# EAGLE design PCB-MIDI-OUT (EAGLE 7.5.0)

## Sheet 1 of 2
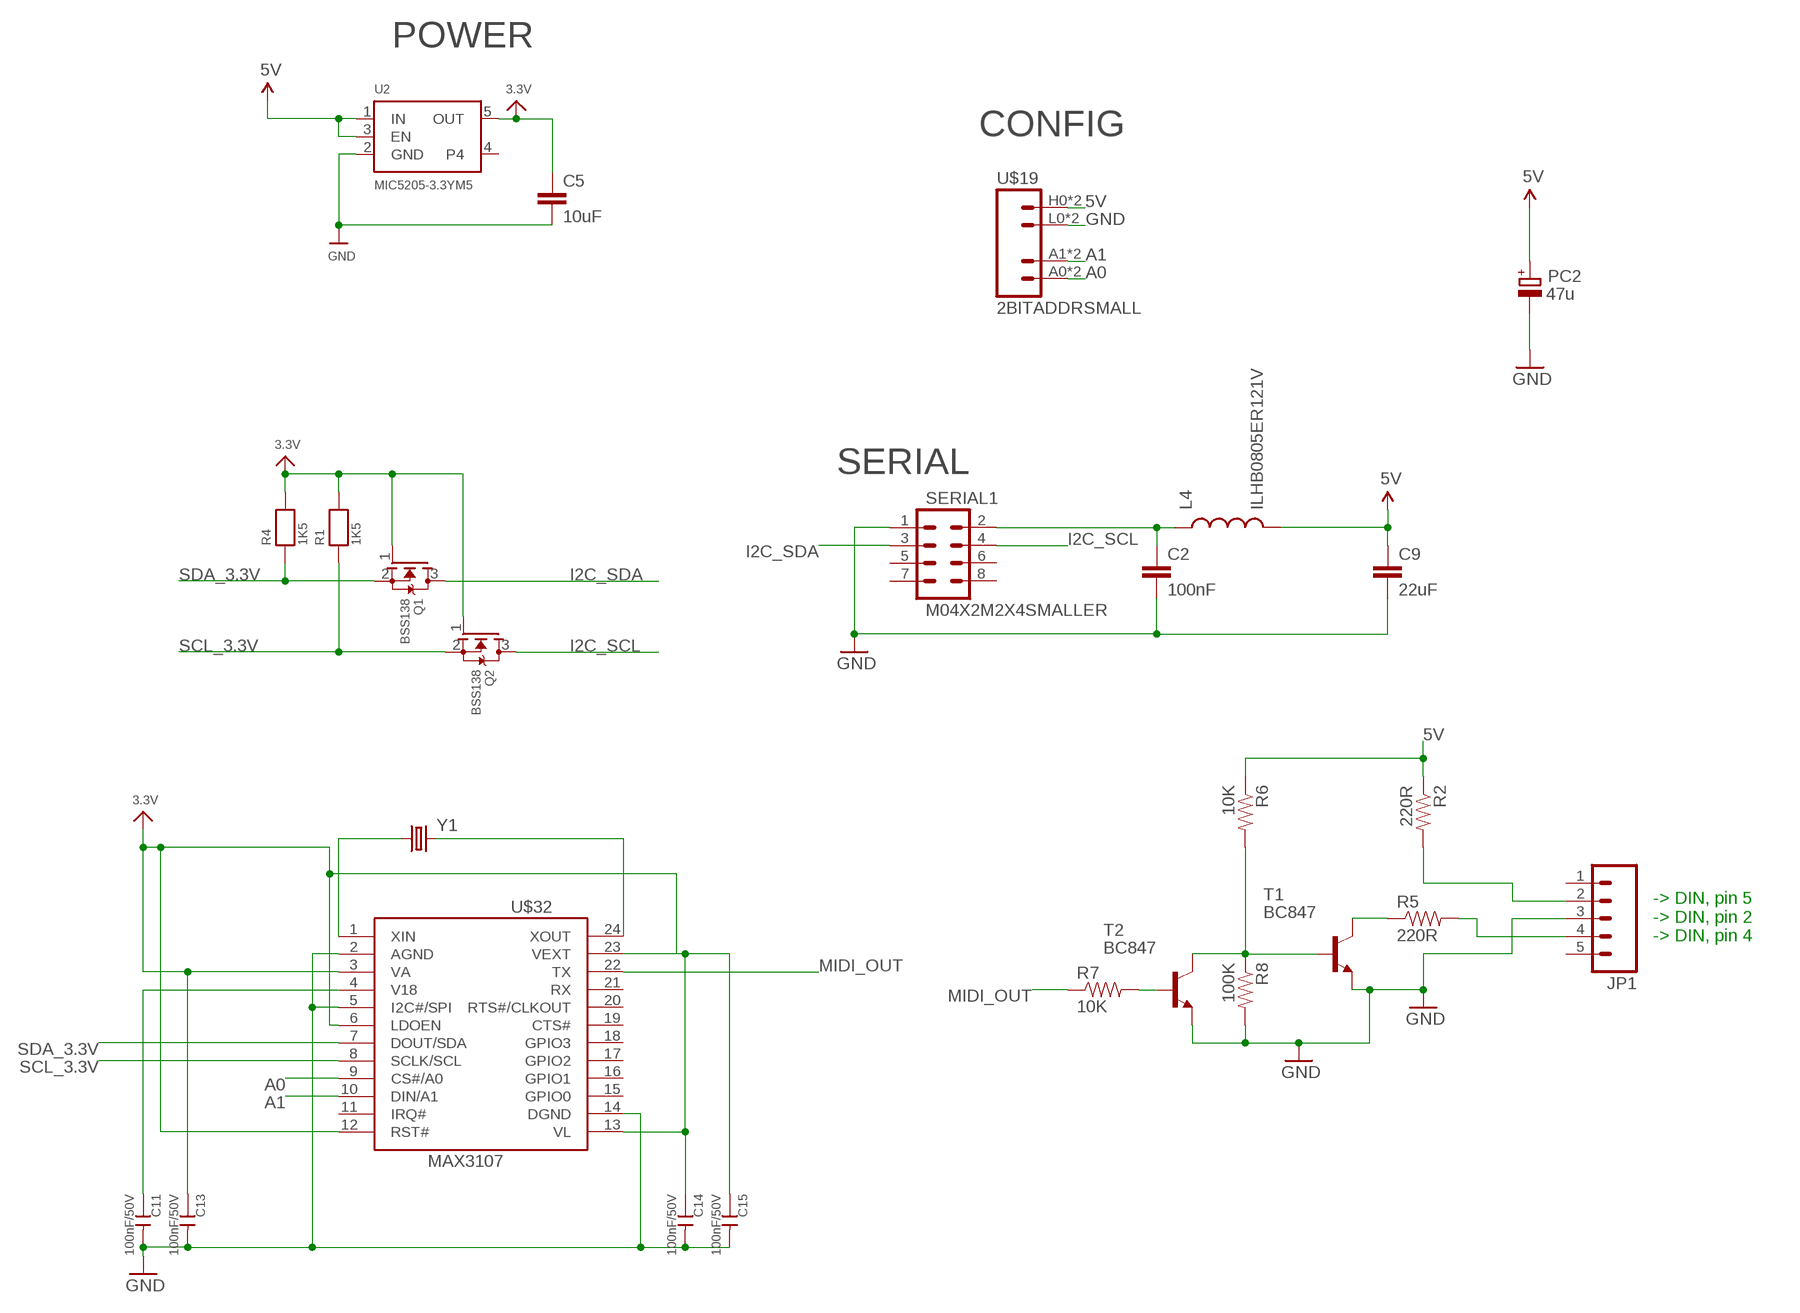
[diagram p0: schematic, sheet 1]

### Parts
C2  100nF  CAP0603-CAP  [0603-CAP]
C5  10uF  CAP0805  [0805]
C9  22uF  CAP0805  [0805]
C11  100nF/50V  CAP-0603  [C0603]
C13  100nF/50V  CAP-0603  [C0603]
C14  100nF/50V  CAP-0603  [C0603]
C15  100nF/50V  CAP-0603  [C0603]
JP1  M05LOCK  [1X05_LOCK]
L4  ILHB0805ER121V  INDUCTOR0805  [0805]
PC2  47u  CPOL-EUD  [PANASONIC_D]
Q1  BSS138  MOSFET-NREFLOW  [SOT23-R]
Q2  BSS138  MOSFET-NREFLOW  [SOT23-R]
R1  1K5  RESISTOR0603  [0603]
R2  220R  RESISTOR0603-RES  [0603-RES]
R4  1K5  RESISTOR0603  [0603]
R5  220R  RESISTOR0603-RES  [0603-RES]
R6  10K  RESISTOR0603-RES  [0603-RES]
R7  10K  RESISTOR0603-RES  [0603-RES]
R8  100K  RESISTOR0603-RES  [0603-RES]
SERIAL1  M04X2M2X4SMALLER  [M2X4SMALLER]
T1  BC847  [SOT23]
T2  BC847  [SOT23]
U2  MIC5205-3.3YM5  VREG_SOT23-5  [SOT23-5]
U$19  2BITADDRSMALL  [2BITADDR_SMALL]
U$32  MAX3107  [SSOP24]
Y1  CRYSTALHC49US  [HC49US]

### Nets
3.3V [Power]: C5.1 C13.1 C14.1 C15.1 Q1.1(G) Q2.1(G) R1.2 R4.2 U2.5(OUT) U$32.3(VA) U$32.6(LDOEN) U$32.12(RST#) U$32.13(VL) U$32.23(VEXT)
5V [Power]: C9.1 L4.2 PC2.+ R2.1 R6.1 U2.1(IN) U2.3(EN) U$19.H0(VCC) U$19.H1(VCC)
A0: U$19.A0(A1) U$19.AS0(A1) U$32.9(CS#/A0)
A1: U$19.A1(A2) U$19.AS1(A2) U$32.10(DIN/A1)
GND [Power]: C2.2 C5.2 C9.2 C11.2 C13.2 C14.2 C15.2 JP1.3 PC2.- R8.2 SERIAL1.1 T1.2(E) T2.2(E) U2.2(GND) U$19.L0(GND) U$19.L1(GND) U$32.2(AGND) U$32.5(I2C#/SPI) U$32.14(DGND)
I2C_SCL: Q2.3(D) SERIAL1.4
I2C_SDA: Q1.3(D) SERIAL1.3
MIDI_OUT: R7.1 U$32.22(TX)
N$3 [Power]: C2.1 L4.1 SERIAL1.2
N$4: R6.2 R8.1 T1.1(B) T2.3(C)
N$5: JP1.2 R2.2
N$6: C11.1 U$32.4(V18)
N$8: R5.1 T1.3(C)
N$9: JP1.4 R5.2
N$11: U$32.1(XIN) Y1.1
N$12: R7.2 T2.1(B)
N$27: U$32.24(XOUT) Y1.2
SCL_3.3V: Q2.2(S) R1.1 U$32.8(SCLK/SCL)
SDA_3.3V: Q1.2(S) R4.1 U$32.7(DOUT/SDA)
Unconnected: JP1.1 JP1.5 SERIAL1.5 SERIAL1.6 SERIAL1.7 SERIAL1.8 U2.4 U$32.11(IRQ#) U$32.15(GPIO0) U$32.16(GPIO1) U$32.17(GPIO2) U$32.18(GPIO3) U$32.19(CTS#) U$32.20(RTS#/CLKOUT) U$32.21(RX)

### Notes on the sheet
- POWER
- CONFIG
- SERIAL
- -> DIN, pin 5
  -> DIN, pin 2
  -> DIN, pin 4

## Sheet 2 of 2

## Library data of the parts
C2 C5 C9 = SparkFun:CAP: Capacitor Standard 0603 ceramic capacitor, and 0.1" leaded capacitor.
C11 C13-C15 = OPL:CAP: Ceramic Capacitors
JP1 = SparkFun:M05: Header 5 Standard 5-pin 0.1" header. Use with straight break away headers (SKU : PRT-00116), right angle break away headers (PRT-00553), swiss pins (PRT-00743), machine pins (PRT-00117), and female headers (PRT-00115). Molex polarized connector foot print use with SKU : PRT-08230 with associated crimp pins and housings.
L4 = SparkFun:INDUCTOR: Inductors Basic Inductor/Choke - 0603 and 1206. Footprints are not proven and vary greatly between part numbers.
PC2 = rcl:CPOL-EU: POLARIZED CAPACITOR, European symbol
Q1 Q2 = microbuilder:MOSFET-N: N-Channel Mosfet LEGEND VDS: Voltage Drain-Source ID: Drain Current RDS(ON): Drain-Source On-State Resistance VGS(TH): Gate-Source Threshold Voltage CISS: Drain-Source Input Capacitance SOT-23 Name VDS ID RDS(ON) VGS(TH) CISS Order Number 2N7002E 60V 260mA 2.5 Ohm 2.5V @ 250uA 26.7pF @ 25V 2N7002ET1GOSTR-ND BSH103 30V 850mA 400 mOhm 400mV @ 1mA 83pF @ 24V BSH103,235-ND BSS138 60V 320mA 1.6 Ohm 1.5V @ 250uA 50pF @ 10V Mouser: 771-BSS138PW115 DMN2075U-7 20V 4.2A 38 mOhm 1V @ 250 uA 594.3pF @ 10V DMN2075U-7DICT-ND * BSS138 good choice for I2C level-shifting
R1 R4 = microbuilder:RESISTOR: Resistors 0402 - 0402 Surface Mount Package 22 Ohm 1% 1/16W [Digikey: 311-22.0LRTR-ND] 33 Ohm 5% 1/16W 1.0K 5% 1/16W 1.5K 5% 1/16W 2.0K 1% 1/16W 10.0K 1% 1/16W [Digikey: 311-10.0KLRTR-ND] 10.0K 5% 1/16W [Digikey: RMCF0402JT10K0TR-ND] 12.1K 1% 1/16W [Digikey: 311-22.0LRTR-ND] 100.0K 5% 1/16W 0603 - 0603 Surface Mount Package 0 Ohm 1/10 Watt 1% Resistor 15 Ohm 1/10 Watt 1% Resistor 33 Ohm 1/10 Watt 1% Resistor 49.9 Ohm 1/10 Watt 1% Resistor 100 Ohm 1/10 Watt 1% Resistor 150 Ohm 1/10 Watt 1% Resistor 240 Ohm 1/10 Watt 1% Resistor 390 Ohm 1/10 Watt 1% Resistor 560 Ohm 1/10 Watt 1% Resistor 680 Ohm 1/10 Watt 1% Resistor 750 Ohm 1/10 Watt 1% Resistor 1.0K Ohm 1/10 Watt 1% Resistor 1.5K Ohm 1/10 Watt 1% Resistor 2.0K Ohm 1/10 Watt 1% Resistor 2.2K Ohm 1/10 Watt 1% Resistor 3.3K Ohm 1/10 Watt 1% Resistor 4.7K Ohm 1/10 Watt 1% Resistor 10.0K Ohm 1/10 Watt 1% Resistor 12.0K Ohm 1/10 Watt 1% Resistor 12.1K Ohm 1/10 Watt 1% Resistor 20.0K Ohm 1/10 Watt 1% Resistor 33.0K Ohm 1/10 Watt 1% Resistor 100.0K Ohm 1/10 Watt 1% Resistor 0805 - 0805 Surface Mount Package 0 Ohm 1/8 Watt 1% Resistor 33 Ohm 1/8 Watt 1% Resistor 100 Ohm 1/8 Watt 1% Resistor 150 Ohm 1/8 Watt 1% Resistor 200 Ohm 1/8 Watt 1% Resistor 240 Ohm 1/8 Watt 1% Resistor 330 Ohm 1/8 Watt 1% Resistor 390 Ohm 1/8 Watt 1% Resistor 470 Ohm 1/8 Watt 1% Resistor 1.0K Ohm 1/8 Watt 1% Resistor 1.5K Ohm 1/8 Watt 1% Resistor 2.0K Ohm 1/8 Watt 1% Resistor 4.7K Ohm 1/8 Watt 1% Resistor 5.1K Ohm 1/8 Watt 1% Resistor 5.6K Ohm 1/8 Watt 1% Resistor 10.0K Ohm 1/8 Watt 1% Resistor 22.0K Ohm 1/8 Watt 1% Resistor 33.0K Ohm 1/8 Watt 1% Resistor 100K Ohm 1/8 Watt 1% Resistor 1206 - 1206 Surface Mount Package 2012 - 2010 Surface Mount Package 0.11 Ohm 1/2 Watt 1% Resistor - Digikey: RHM.11UCT-ND
R2 R5-R8 = SparkFun:RESISTOR: Resistor Basic schematic elements and footprints for 0603, 1206, and PTH resistors.
SERIAL1 = SKAARHOJ:M04X2
T1 T2 = transistor:BC847: NPN TRANSISTOR
U2 = microbuilder:VREG_SOT23-5: SOT23-5 Fixed Voltage Regulators To better organise some of the SOT23-5 fixed voltage regulators in this library, this new part was created. Part Current Out V Out V In V Dropout Digikey Part No. ADP121 150mA 3.3V 3.4-5.5V 0.09V @ 150mA ADP121-AUJZ33R7CT-ND ADP121 150mA 3.0V 3.1-5.5V 0.09V @ 150mA ADP121-AUJZ30R7CT-ND ADP122 300mA 3.3V 3.4-5.5V 0.085V @ 300mA ADP122AUJZ-3.3-R7CT-ND ADP1712 300mA 3.3V 3.5-5.5V 0.17V @ 300mA ADP1712AUJZ-3.3-R7TR-ND AP7311 (Low Cost) 150mA 3.3V 3.5-6V 0.15V @ 150mA AP7311-33WG-7DICT-ND LD39015M18R 150mA 1.8V 1.9V-5.5V 0.08V @ 100mA 497-6977-1-ND MCP1824T-3302E/OT 300mA 3.3V 3.5V-6V 0.2V @ 300mA MCP1824T-3302E/OTCT-ND MIC5205-2.5YM5 TR 150mA 2.5V 2.7-16V 0.165V @ 150mA 576-1257-2-ND MIC5205-3.0YM5 TR 150mA 3.0V 3.2V-16V 0.165V @ 150mA 576-1258-2-ND MIC5205-3.3YM5 TR 150mA 3.3V 3.5V-16V 0.165V @ 150mA 576-1259-2-ND TPS780330220 150mA 3.3V+2.2V 3.6-5.5V 250mV Max 296-23332-1-ND TDA3663/N1,135 100mA 3.3V 3.5-45V 0.18V @ 50mA 568-5343-1-ND
U$19 = SKAARHOJ:2BITADDR
U$32 = SKAARHOJ:MAX3107
Y1 = SparkFun:CRYSTAL: Crystals Various standard crystals. Proven footprints. Spark Fun Electronics SKU : COM-00534

## Net classes
0 default: width 0.203 mm, drill 0.406 mm, clearance 0.203 mm
1 Power: width 0.406 mm, drill 0.61 mm, clearance 0.203 mm
2 RELAY LINES: width 0.305 mm, drill 0.406 mm, clearance 0.254 mm
3 INput lines: width 0.203 mm, drill 0.406 mm, clearance 0.254 mm

## Board
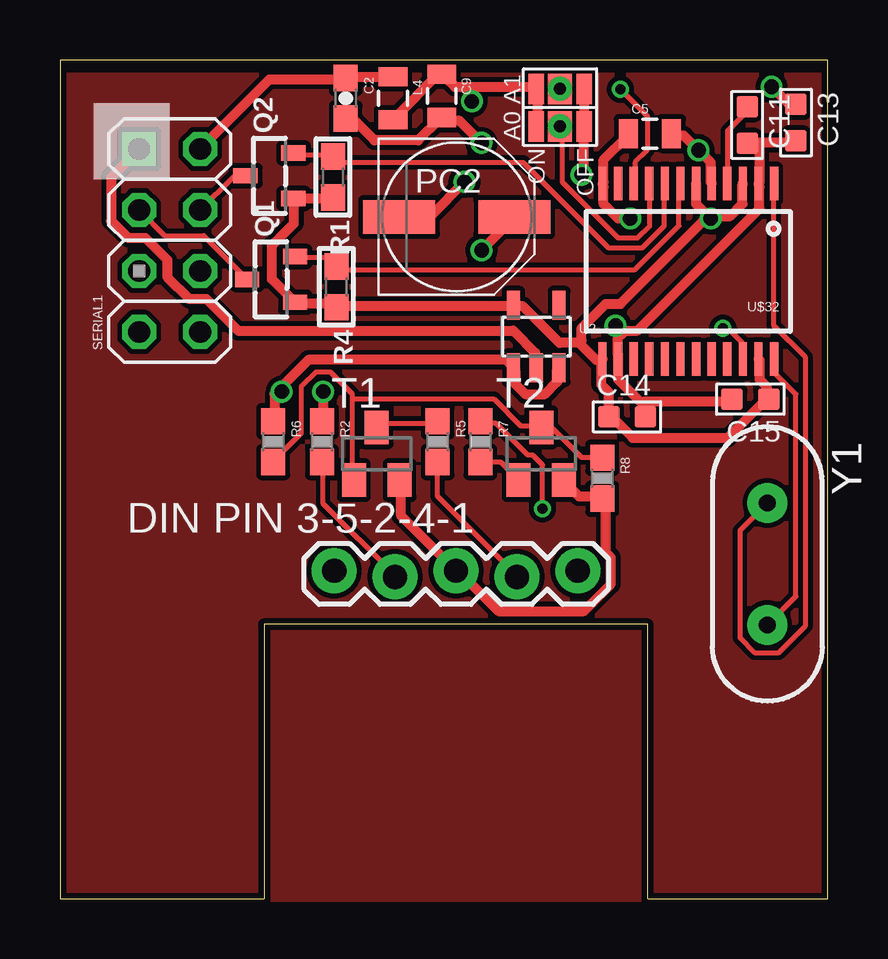
[diagram p1: board, top side]
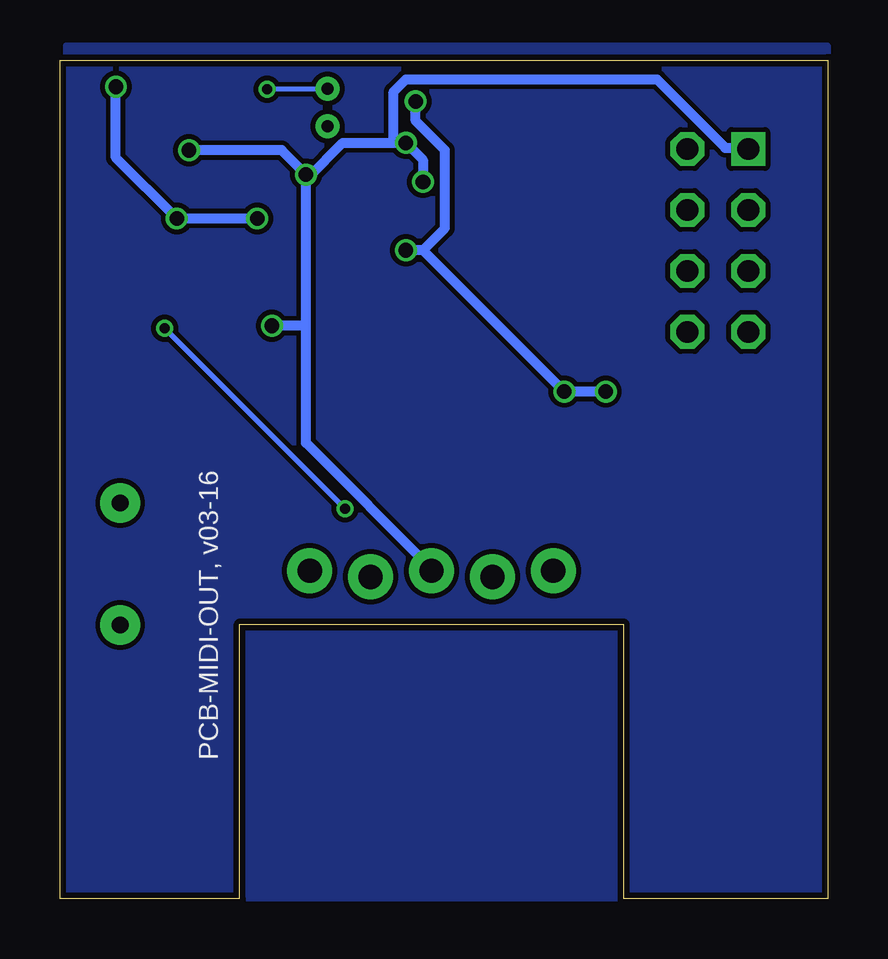
[diagram p2: board, bottom side, seen from below]

Size 32 x 34.95 mm. Coordinates in mm from the lower left corner, seen from the top.
Outline: 32,0 32,34.95 0,34.95 0,0 8.51,0 8.51,11.43 24.51,11.43 24.51,0 32,0
Copper layers (1*16): Top 0.035mm / dielectric 1.5mm / Bottom 0.035mm
Design rules "Fusion_eagle_rule_v1.1": minimum track width 6mil, minimum drill 12mil, track to track 6mil, track to pad 6mil, pad to pad 6mil, via to via 6mil, smd to smd 0mil, copper to edge 10mil, drill to drill 10mil, minimum pad ring 10mil, minimum via ring 6mil, stop-mask expansion 2mil, vias tented up to drill 100mil, thermal gap 10mil

### Footprints (pad centres in the part's own frame; a part is rotated, then mirrored left to right if it is on the bottom)
0603-CAP = smd 1.1 x 1: 1 -0.85,0; 2 0.85,0
0805 = smd 0.8 x 1.2: 1 -0.9,0; 2 0.9,0
C0603 = smd 0.889 x 0.889: 1 -0.762,0; 2 0.762,0
1X05_LOCK = drill 1.016 pad 1.88: 1 0,0.127; 2 2.54,-0.127; 3 5.08,0.127; 4 7.62,-0.127; 5 10.16,0.127
PANASONIC_D = smd 3 x 1.4: + 2.4,0; - -2.4,0
SOT23-R = smd 0.635 x 1.016: 1 -0.95,-1; 2 0.95,-1; 3 0,1
0603 = smd 1.1 x 1: 1 -0.85,0; 2 0.85,0
0603-RES = smd 1.1 x 1: 1 -0.85,0; 2 0.85,0
M2X4SMALLER = drill 0.9 square: 1 -1.27,3.81 | drill 0.9 octagon: 2 1.27,3.81; 3 -1.27,1.27; 4 1.27,1.27; 5 -1.27,-1.27; 6 1.27,-1.27; 7 -1.27,-3.81; 8 1.27,-3.81
SOT23 = smd 1 x 1.4: 1 -0.95,-1.1; 2 0.95,-1.1; 3 0,1.1
SOT23-5 = smd 0.55 x 1.2: 1 -0.95,-1.3; 2 0,-1.3; 3 0.95,-1.3; 4 0.95,1.3; 5 -0.95,1.3
2BITADDR_SMALL = drill 0.5: A0 -1.565,0; A1 0,0 | smd 1.27 x 1: AS0 -1.565,0; AS1 0,0 | smd 1.27 x 0.635: H0 -1.565,1; H1 0,1; L0 -1.565,-1; L1 0,-1
SSOP24 = smd 0.348 x 1.397: 1 -3.575,-3.656; 2 -2.925,-3.656; 3 -2.275,-3.656; 4 -1.625,-3.656; 5 -0.975,-3.656; 6 -0.325,-3.656; 7 0.325,-3.656; 8 0.975,-3.656; 9 1.625,-3.656; 10 2.275,-3.656; 11 2.925,-3.656; 12 3.575,-3.656; 13 3.575,3.656; 14 2.925,3.656; 15 2.275,3.656; 16 1.625,3.656; 17 0.975,3.656; 18 0.325,3.656; 19 -0.325,3.656; 20 -0.975,3.656; 21 -1.625,3.656; 22 -2.275,3.656; 23 -2.925,3.656; 24 -3.575,3.656
HC49US = drill 0.7 pad 1.651: 1 -2.54,0; 2 2.54,0

### Placement (x,y rotation side)
C2  11.92,33.36 270 top
C5  24.59,31.88 0 top
C9  15.92,33.45 270 top
C11  28.65,32.24 270 top
C13  30.68,32.34 270 top
C14  23.64,20.08 0 top
C15  28.78,20.82 180 top
JP1  11.43,13.54 0 top
L4  13.88,33.36 270 top
PC2  16.54,28.41 0 top
Q1  8.8,25.81 90 top
Q2  8.74,30.13 90 top
R1  11.38,30.07 270 top
R2  10.92,19.05 270 top
R4  11.52,25.5 270 top
R5  15.75,19.05 270 top
R6  8.89,19.05 270 top
R7  17.53,19.05 270 top
R8  22.61,17.53 270 top
SERIAL1  4.57,27.43 0 top
T1  13.21,18.54 0 top
T2  20.07,18.54 0 top
U2  19.86,23.43 0 top
U$19  20.85,33.75 90 top
U$32  26.19,26.14 180 top
Y1  29.49,13.95 270 top

### Tracks (layer width: path | path; a pad name or v marks a point on that pad's centre or on a via)
3.3V  (via drill 0.61)
  Top 0.406: C5.1 23.67,31.8 22.66,30.79 22.66,29.87 U$32.12 22.66,29.67 22.66,28.96 23.27,28.35 v23.77,28.35 | v29.67,33.83 30.38,33.12 30.58,33.12 C13.1 | v27.13,28.35 26.52,28.96 26.52,29.77 U$32.6 | U$32.3 28.45,29.77 28.45,28.96 27.94,28.45 27.23,28.45 v27.13,28.35 | R1.2 11.28,29.16 9.75,29.16 Q2.1 9.75,28.96 9.75,28.14 8.84,27.23 8.84,25.81 9.65,24.99 Q1.1 9.86,24.79 11.38,24.79 11.48,24.69 R4.2 11.68,24.69 18.8,24.69 U2.5 19,24.69 19.3,24.69 20.83,23.16 21.64,23.16 | U$32.23 29.16,22.45 29.16,21.64 29.46,21.34 29.46,20.83 C15.1 29.36,20.73 27.84,19.2 23.88,19.2 23.06,20.02 C14.1 22.86,20.12 22.86,21.13 22.55,21.44 22.55,22.45 | 22.55,22.45 U$32.13 | 21.64,23.16 22.35,22.45 22.55,22.45 | v27.13,28.35 26.92,28.35 23.37,24.79 22.76,24.79 21.74,23.77 21.74,23.27 21.64,23.16
  Bottom 0.406: v29.67,33.83 29.67,30.89 v27.13,28.35 v23.77,28.35
5V  (via drill 0.61)
  Top 0.406: U$19.H0 19.91,32.21 19.91,33.73 U$19.H1 19.71,33.83 17.17,33.83 | L4.2 13.92,32.51 15.85,34.44 C9.1 16.05,34.24 16.46,33.83 17.17,33.83 | 9.14,21.23 10.36,22.45 18.59,22.45 18.9,22.15 U2.1 19,21.95 19,21.44 19.41,21.03 20.22,21.03 20.73,21.54 20.73,22.05 U2.3 | 9.14,21.23 8.94,21.03 8.94,19.91 R6.1 | v10.97,21.13 10.97,19.91 R2.1 | v9.25,21.13 9.14,21.23 | v17.58,27.03 18.9,28.35 PC2.+ | v17.17,33.22 17.17,33.83
  Bottom 0.406: v9.25,21.13 v10.97,21.13 16.87,27.03 | 16.87,27.03 v17.58,27.03 | v17.17,33.22 17.17,32.41 15.95,31.19 15.95,27.94 16.87,27.03
A0
  Top 0.203: 20.93,32.21 U$19.AS0 20.93,32.11 20.93,29.87 23.27,27.53 24.08,27.53 24.59,28.04 24.59,29.77 U$32.9
A1  (via drill 0.41)
  Top 0.203: 20.93,33.73 U$19.AS1 | v23.37,33.73 24.49,32.61 24.49,31.19 23.98,30.68 23.98,29.87 U$32.10
  Bottom 0.203: v23.37,33.73 20.93,33.73 U$19.AS1
GND  (via drill 0.61)
  Top 0.406: SERIAL1.1 2.13,30.07 2.13,28.25 2.85,27.53 3.56,27.53 4.47,26.62 4.47,25.91 5.38,24.99 6.1,24.99 7.42,23.67 18.9,23.67 19.81,22.76 19.81,22.15 U2.2 | 29.16,31.5 30.58,31.5 C13.2 | 29.16,31.5 28.65,31.5 C11.2 | 29.16,31.5 29.16,29.87 U$32.2 29.16,29.67 29.16,28.75 24.08,23.67 23.57,23.67 23.47,23.57 | 24.28,20.62 23.27,21.64 23.27,22.45 U$32.14 23.27,22.66 23.27,23.37 23.47,23.57 | 24.28,20.62 24.38,20.52 24.38,20.12 C14.2 | C15.2 27.94,20.73 24.38,20.73 24.28,20.62 | C2.2 11.99,32.41 12.29,32.41 13.11,31.6 14.94,31.6 15.85,32.51 C9.2 16.05,32.41 16.66,32.41 v17.58,31.5 | C5.2 25.5,31.8 26.01,31.8 v26.62,31.19 27.13,30.68 27.13,29.87 U$32.5 | T2.2 21.03,17.37 21.64,16.76 22.55,16.76 R8.2 22.76,16.56 22.76,14.43 22.96,14.22 22.96,13.11 21.84,11.99 18.29,11.99 16.66,13.61 JP1.3 16.46,13.72 14.22,15.95 14.22,17.37 T1.2 | U$19.L1 21.84,33.73 21.84,32.21 U$19.L0 21.84,32 21.84,30.28 v21.74,30.18 | v16.87,29.87 15.44,28.45 14.22,28.45 PC2.- | v23.16,23.88 23.47,23.57
  Bottom 0.406: 21.74,23.88 21.74,19 16.46,13.72 JP1.3 | 21.74,23.88 v21.74,30.18 | v26.62,31.19 22.76,31.19 v21.74,30.18 | 18.09,31.5 20.22,31.5 21.64,30.07 v21.74,30.18 | 18.09,31.5 v17.58,31.5 16.87,30.79 v16.87,29.87 | 21.74,23.88 v23.16,23.88 | 18.09,31.5 18.09,33.63 17.58,34.14 7.11,34.14 4.27,31.29 3.35,31.29 SERIAL1.1
I2C_SCL
  Top 0.203: SERIAL1.4 7.21,30.07 7.72,30.07 Q2.3
I2C_SDA
  Top 0.203: SERIAL1.3 4.37,27.64 5.99,27.64 7.72,25.91 Q1.3
MIDI_OUT  (via drill 0.41)
  Top 0.203: v20.12,16.26 20.12,18.09 19.71,18.49 19.51,18.49 18.19,19.81 17.58,19.81 R7.1 | v27.64,23.77 27.84,23.77 28.45,23.16 28.45,22.55 U$32.22
  Bottom 0.203: v27.64,23.77 v20.12,16.26
N$1
  pour Top: 0,0 31.75,0 31.75,34.29 0,34.29
N$2
  pour Bottom: 0,0 31.75,0 31.75,35.56 0,35.56
N$3
  Top 0.406: L4.1 13.82,34.24 11.99,34.24 C2.1 11.79,34.14 8.74,34.14 SERIAL1.2
N$4
  Top 0.203: R8.1 22.55,18.39 21.74,18.39 20.52,19.61 20.12,19.61 T2.3 20.02,19.71 19.2,19.71 18.09,20.83 12.19,20.83 | 12.19,20.83 12.19,17.48 T1.1 | 12.19,20.83 12.19,21.03 11.28,21.95 10.67,21.95 10.06,21.34 10.06,19.41 8.94,18.29 R6.2
N$5
  Top 0.203: R2.2 10.97,18.19 10.97,16.46 13.92,13.51 JP1.2
N$6
  Top 0.203: C11.1 28.55,32.92 28.55,32.72 27.84,32 27.84,29.87 U$32.4
N$8
  Top 0.203: R5.1 15.75,19.81 13.31,19.81 13.21,19.71 T1.3
N$9
  Top 0.203: R5.2 15.75,16.76 19,13.51 JP1.4
N$11
  Top 0.203: U$32.1 29.77,29.77 29.77,23.88 31.09,22.55 31.09,11.38 29.97,10.26 28.96,10.26 28.35,10.87 28.35,15.34 29.46,16.46 Y1.1
N$12
  Top 0.203: R7.2 17.58,18.19 18.39,18.19 19.1,17.48 T2.1
N$27
  Top 0.203: U$32.24 29.77,22.45 29.77,21.95 30.68,21.03 30.68,12.6 29.57,11.48 Y1.2
SCL_3.3V
  Top 0.203: Q2.2 9.75,30.99 11.28,30.99 R1.1 11.38,30.89 11.58,30.68 19.3,30.68 22.86,27.13 24.28,27.13 25.2,28.04 25.2,29.77 U$32.8
SDA_3.3V
  Top 0.203: Q1.2 9.86,26.72 11.18,26.72 11.48,26.42 R4.1 11.58,26.31 11.68,26.21 23.98,26.21 25.81,28.04 25.81,29.77 U$32.7

### Text on the board
_tsilk: DIN PIN 3-5-2-4-1
_bsilk: PCB-MIDI-OUT, v03-16